# Altium schematic sheet STM32F1_CNC_SCHB.SchDoc
size A4
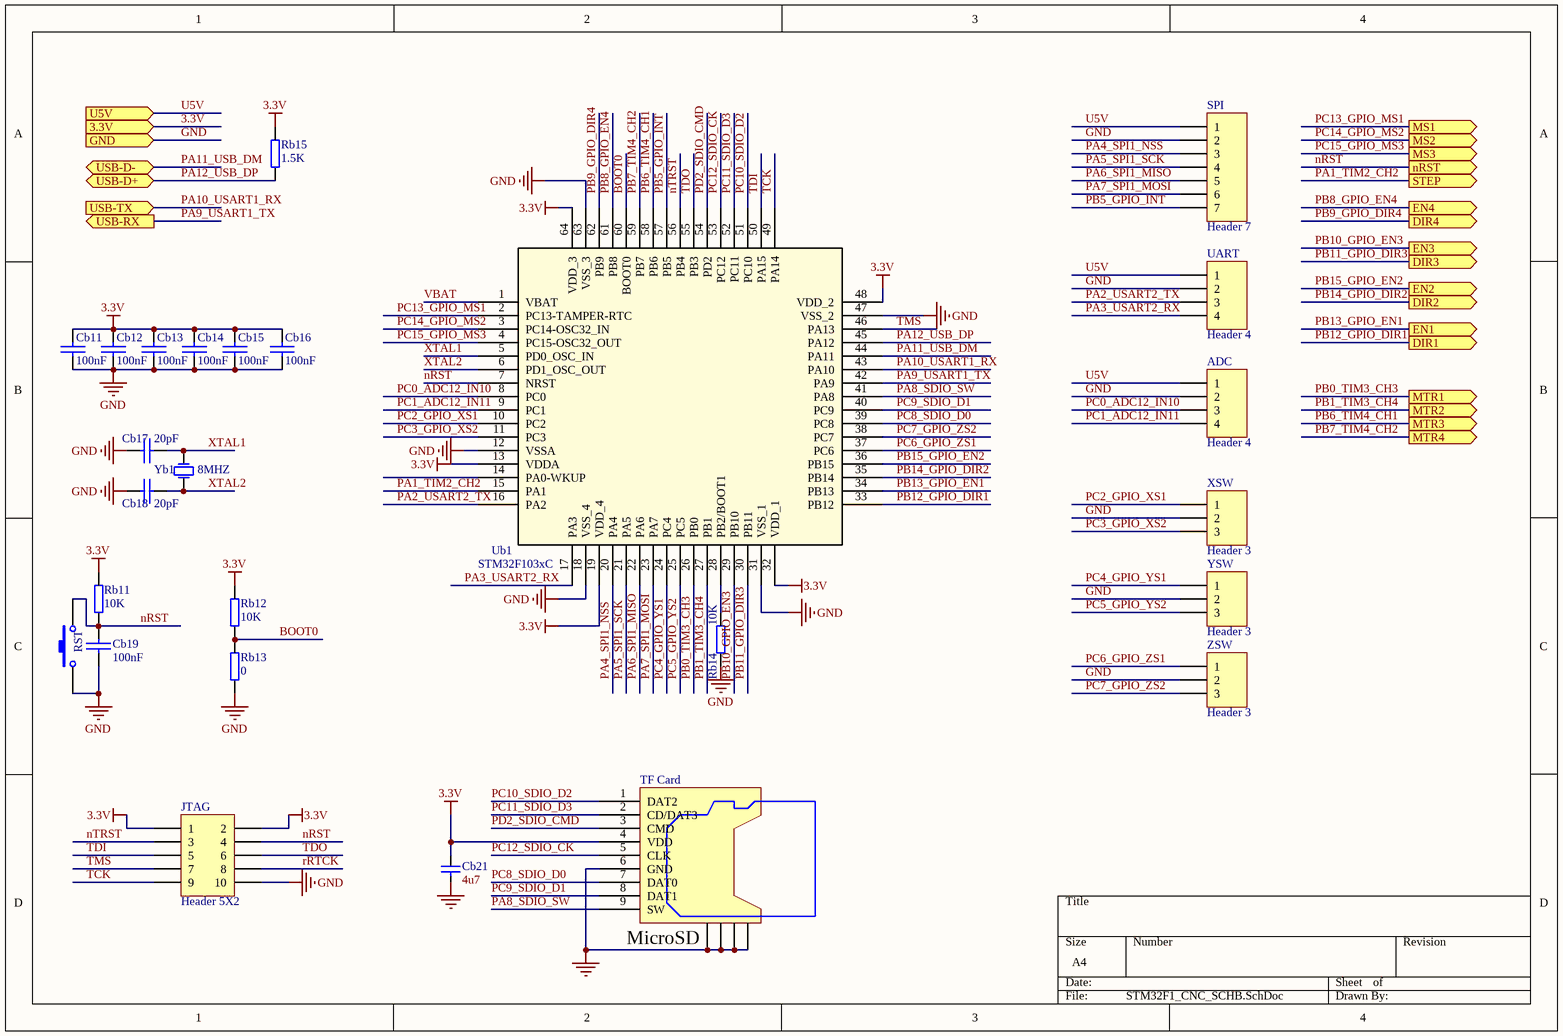
[diagram p0: STM32F1_CNC_SCHB.SchDoc]

## Parts
ADC  Header 4  [HDR-2.54-4P]
Cb11  100nF  [0603]
Cb12  100nF  [0603]
Cb13  100nF  [0603]
Cb14  100nF  [0603]
Cb15  100nF  [0603]
Cb16  100nF  [0603]
Cb17  20pF  [0603]
Cb18  20pF  [0603]
Cb19  100nF  [0603]
Cb21  4u7  [0603]
JTAG  Header 5X2  [IDC10P-2.54]
Rb11  10K  [0603]
Rb12  10K  [0603]
Rb13  0  [0603]
Rb14  10K  [0603]
Rb15  1.5K  [0603]
RST  SW-PB  [RST-6*6]  (value not drawn)
SPI  Header 7  [HDR-2.54-7P]
TF_Card  microSD PUSH-PULL  [TF Card]  (value not drawn)
UART  Header 4  [HDR-2.54-4P]
Ub1  STM32F103xC  [QFP64]
XSW  Header 3  [HDR-2.54-3P]
Yb1  8MHZ  [XTAL-3215-2P]
YSW  Header 3  [HDR-2.54-3P]
ZSW  Header 3  [HDR-2.54-3P]

## Ports
3.3V (in), DIR1 (out), DIR2 (out), DIR3 (out), DIR4 (out), EN1 (out), EN2 (out), EN3 (out), EN4 (out), GND (in), MS1 (out), MS2 (out), MS3 (out), MTR1 (out), MTR2 (out), MTR3 (out), MTR4 (out), nRST (out), STEP (out), U5V (in), USB-D+ (bidir), USB-D- (bidir), USB-RX (out), USB-TX (in)

## Nets
3.3V: Cb11.1 Cb12.1 Cb13.1 Cb14.1 Cb15.1 Cb16.1 Cb21.2 JTAG.1 JTAG.2 Rb11.1 Rb12.1 Rb15.1 TF_Card.4(VDD) Ub1.13(VDDA) Ub1.19(VDD_4) Ub1.32(VDD_1) Ub1.48(VDD_2) Ub1.64(VDD_3) ; port 3.3V
GND: ADC.2 Cb11.2 Cb12.2 Cb13.2 Cb14.2 Cb15.2 Cb16.2 Cb17.1 Cb18.1 Cb19.2 Cb21.1 JTAG.10 Rb13.2 Rb14.2 RST.2 SPI.2 TF_Card.6(GND) TF_Card.GP1 TF_Card.GP2 TF_Card.GP3 TF_Card.GP4 UART.2 Ub1.12(VSSA) Ub1.18(VSS_4) Ub1.31(VSS_1) Ub1.47(VSS_2) Ub1.63(VSS_3) XSW.2 YSW.2 ZSW.2 ; port GND
BOOT0: Rb12.2 Rb13.1 Ub1.60(BOOT0)
nRST: Cb19.1 JTAG.4 Rb11.2 RST.1 Ub1.7(NRST) ; port nRST
nTRST: JTAG.3 Ub1.56(PB4)
PA1_TIM2_CH2: Ub1.15(PA1) ; port STEP
PA2_USART2_TX: UART.3 Ub1.16(PA2)
PA3_USART2_RX: UART.4 Ub1.17(PA3)
PA4_SPI1_NSS: SPI.3 Ub1.20(PA4)
PA5_SPI1_SCK: SPI.4 Ub1.21(PA5)
PA6_SPI1_MISO: SPI.5 Ub1.22(PA6)
PA7_SPI1_MOSI: SPI.6 Ub1.23(PA7)
PA8_SDIO_SW: TF_Card.9(SW) Ub1.41(PA8)
PA9_USART1_TX: Ub1.42(PA9) ; port USB-RX
PA10_USART1_RX: Ub1.43(PA10) ; port USB-TX
PA11_USB_DM: Ub1.44(PA11) ; port USB-D-
PA12_USB_DP: Rb15.2 Ub1.45(PA12) ; port USB-D+
PB0_TIM3_CH3: Ub1.26(PB0) ; port MTR1
PB1_TIM3_CH4: Ub1.27(PB1) ; port MTR2
PB5_GPIO_INT: SPI.7 Ub1.57(PB5)
PB6_TIM4_CH1: Ub1.58(PB6) ; port MTR3
PB7_TIM4_CH2: Ub1.59(PB7) ; port MTR4
PB8_GPIO_EN4: Ub1.61(PB8) ; port EN4
PB9_GPIO_DIR4: Ub1.62(PB9) ; port DIR4
PB10_GPIO_EN3: Ub1.29(PB10) ; port EN3
PB11_GPIO_DIR3: Ub1.30(PB11) ; port DIR3
PB12_GPIO_DIR1: Ub1.33(PB12) ; port DIR1
PB13_GPIO_EN1: Ub1.34(PB13) ; port EN1
PB14_GPIO_DIR2: Ub1.35(PB14) ; port DIR2
PB15_GPIO_EN2: Ub1.36(PB15) ; port EN2
PC0_ADC12_IN10: ADC.3 Ub1.8(PC0)
PC1_ADC12_IN11: ADC.4 Ub1.9(PC1)
PC2_GPIO_XS1: Ub1.10(PC2) XSW.1
PC3_GPIO_XS2: Ub1.11(PC3) XSW.3
PC4_GPIO_YS1: Ub1.24(PC4) YSW.1
PC5_GPIO_YS2: Ub1.25(PC5) YSW.3
PC6_GPIO_ZS1: Ub1.37(PC6) ZSW.1
PC7_GPIO_ZS2: Ub1.38(PC7) ZSW.3
PC8_SDIO_D0: TF_Card.7(DAT0) Ub1.39(PC8)
PC9_SDIO_D1: TF_Card.8(DAT1) Ub1.40(PC9)
PC10_SDIO_D2: TF_Card.1(DAT2) Ub1.51(PC10)
PC11_SDIO_D3: TF_Card.2(CD/DAT3) Ub1.52(PC11)
PC12_SDIO_CK: TF_Card.5(CLK) Ub1.53(PC12)
PC13_GPIO_MS1: Ub1.2(PC13-TAMPER-RTC) ; port MS1
PC14_GPIO_MS2: Ub1.3(PC14-OSC32_IN) ; port MS2
PC15_GPIO_MS3: Ub1.4(PC15-OSC32_OUT) ; port MS3
PD2_SDIO_CMD: TF_Card.3(CMD) Ub1.54(PD2)
rRTCK: JTAG.8
TCK: JTAG.9 Ub1.49(PA14)
TDI: JTAG.5 Ub1.50(PA15)
TDO: JTAG.6 Ub1.55(PB3)
TMS: JTAG.7 Ub1.46(PA13)
U5V: ADC.1 SPI.1 UART.1 ; port U5V
VBAT: Ub1.1(VBAT)
XTAL1: Cb17.2 Ub1.5(PD0_OSC_IN) Yb1.2(OSC2)
XTAL2: Cb18.2 Ub1.6(PD1_OSC_OUT) Yb1.1(OSC1)
NetRb14_1: Rb14.1 Ub1.28(PB2/BOOT1)

Not connected (* = marked no-connect by the designer): Ub1 14(PA0-WKUP)

## Notes on the sheet
- (near TF_Card) MicroSD

## Library data of the parts
ADC UART = Header 4: Header, 4-Pin; LatestRevisionDate: 17-Jul-2002; LatestRevisionNote: Re-released for DXP Platform.; Publisher: Altium Limited
Cb11-Cb19 = CAP: Capacitor
  Cb11-Cb16 Cb19: value: 100nF
  Cb17 Cb18: value: 20pF
Cb21 = Cap
JTAG = Header 5X2: Header, 5-Pin, Dual row; LatestRevisionDate: 17-Jul-2002; LatestRevisionNote: Re-released for DXP Platform.; Publisher: Altium Limited
Rb11-Rb15 = RES1: Resister
  Rb11: value: 10K
  Rb15: value: 1.5K
RST = SW-PB: Switch; Published: 24-Mar-1999; LatestRevisionDate: 17-Jul-2002; LatestRevisionNote: Re-released for DXP Platform.; PackageReference: SPST-2; Publisher: Altium Limited; PackageDescription: Switch; 2 Leads
SPI = Header 7: Header, 7-Pin; LatestRevisionDate: 17-Jul-2002; LatestRevisionNote: Re-released for DXP Platform.; Publisher: Altium Limited
XSW YSW ZSW = Header 3: Header, 3-Pin; LatestRevisionDate: 17-Jul-2002; LatestRevisionNote: Re-released for DXP Platform.; Publisher: Altium Limited
Yb1 = ECS-10-13-1: Crystal Oscillator; Published: 17-Jul-2002; Datasheet: Latest Revision: 18-Apr-2000; Publisher: Altium Limited